# EAGLE design Comunicação RS232 (EAGLE 6.6.0)
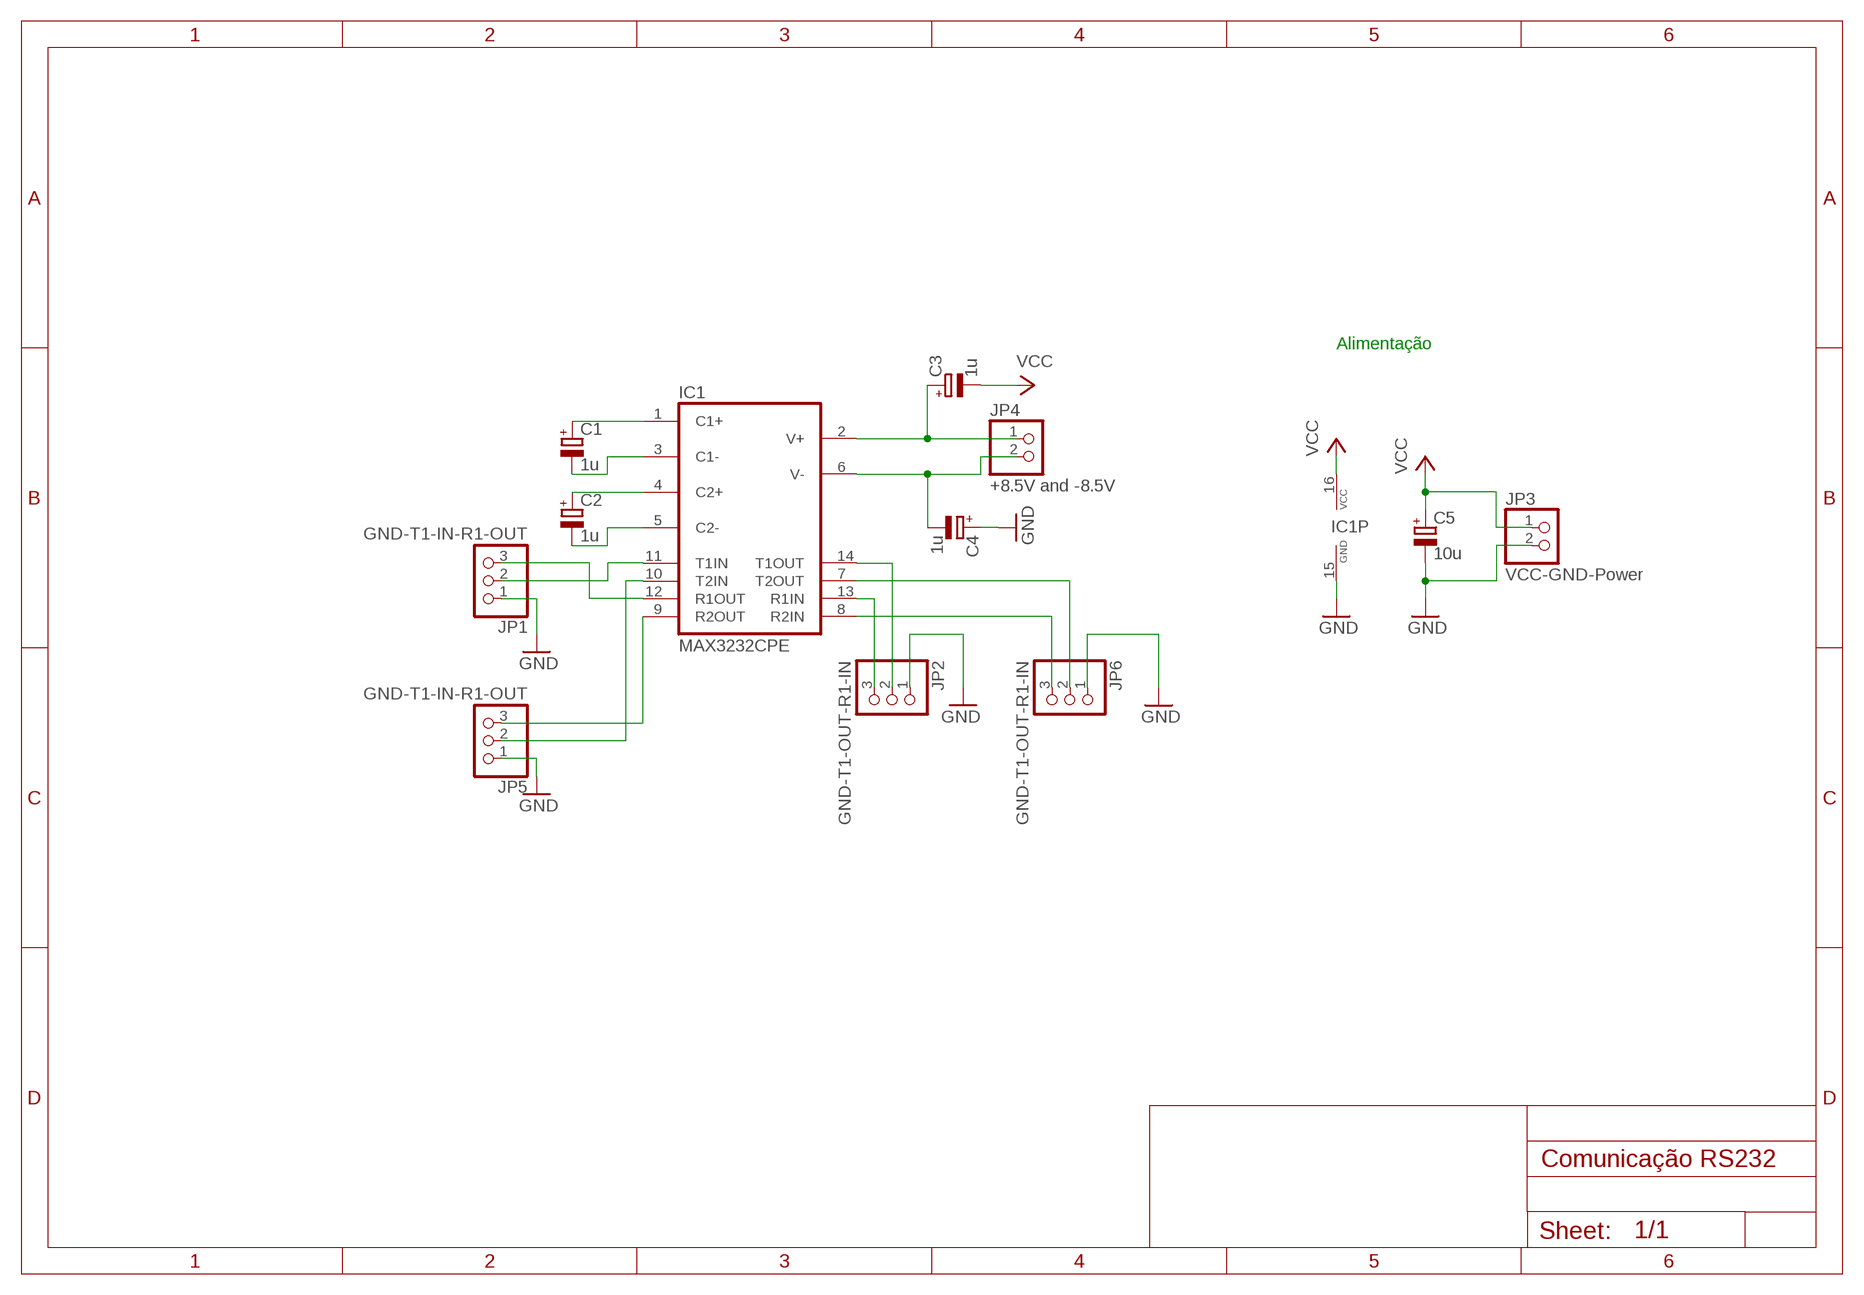
[diagram p0: schematic, sheet 1]

## Parts
C1  1u  CPOL-EUE2.5-5  [E2,5-5]
C2  1u  CPOL-EUE2.5-5  [E2,5-5]
C3  1u  CPOL-EUE2.5-5  [E2,5-5]
C4  1u  CPOL-EUE2.5-5  [E2,5-5]
C5  10u  CPOL-EUE2.5-5  [E2,5-5]
IC1  MAX3232CPE  [DIL16]
JP1  GND-T1-IN-R1-OUT  PINHD-1X3  [1X03]
JP2  GND-T1-OUT-R1-IN  PINHD-1X3  [1X03]
JP3  VCC-GND-Power  PINHD-1X2  [1X02]
JP4  +8.5V and -8.5V  PINHD-1X2  [1X02]
JP5  GND-T1-IN-R1-OUT  PINHD-1X3  [1X03]
JP6  GND-T1-OUT-R1-IN  PINHD-1X3  [1X03]

## Nets
GND: C4.+ C5.- IC1.15(GND) JP1.1 JP2.1 JP3.2 JP5.1 JP6.1
N$1: IC1.11(T1IN) JP1.2
N$2: IC1.12(R1OUT) JP1.3
N$3: C1.+ IC1.1(C1+)
N$4: C1.- IC1.3(C1-)
N$5: C2.+ IC1.4(C2+)
N$6: C2.- IC1.5(C2-)
N$7: C4.- IC1.6(V-) JP4.2
N$8: C3.+ IC1.2(V+) JP4.1
N$9: IC1.14(T1OUT) JP2.2
N$10: IC1.13(R1IN) JP2.3
N$11: IC1.9(R2OUT) JP5.3
N$12: IC1.10(T2IN) JP5.2
N$14: IC1.8(R2IN) JP6.3
N$15: IC1.7(T2OUT) JP6.2
VCC: C3.- C5.+ IC1.16(VCC) JP3.1

## Notes on the sheet
- Alimentação

## Library data of the parts
C1-C5 = rcl:CPOL-EU: POLARIZED CAPACITOR, European symbol
IC1 = maxim:MAX3232*: True RS-232 Transceivers 3.0V to 5.5V, Low-Power up to 1Mbps, Using Four 0.1µF External Capacitors Source: http://pdfserv.maxim-ic.com/en/ds/MAX3222-MAX3241.pdf; MF: MAXIM; MPN: MAX3232CPE+; OC_FARNELL: 9724494; OC_NEWARK: 68K4626
JP1 JP2 JP5 JP6 = pinhead:PINHD-1X3: PIN HEADER
JP3 JP4 = pinhead:PINHD-1X2: PIN HEADER

## Board
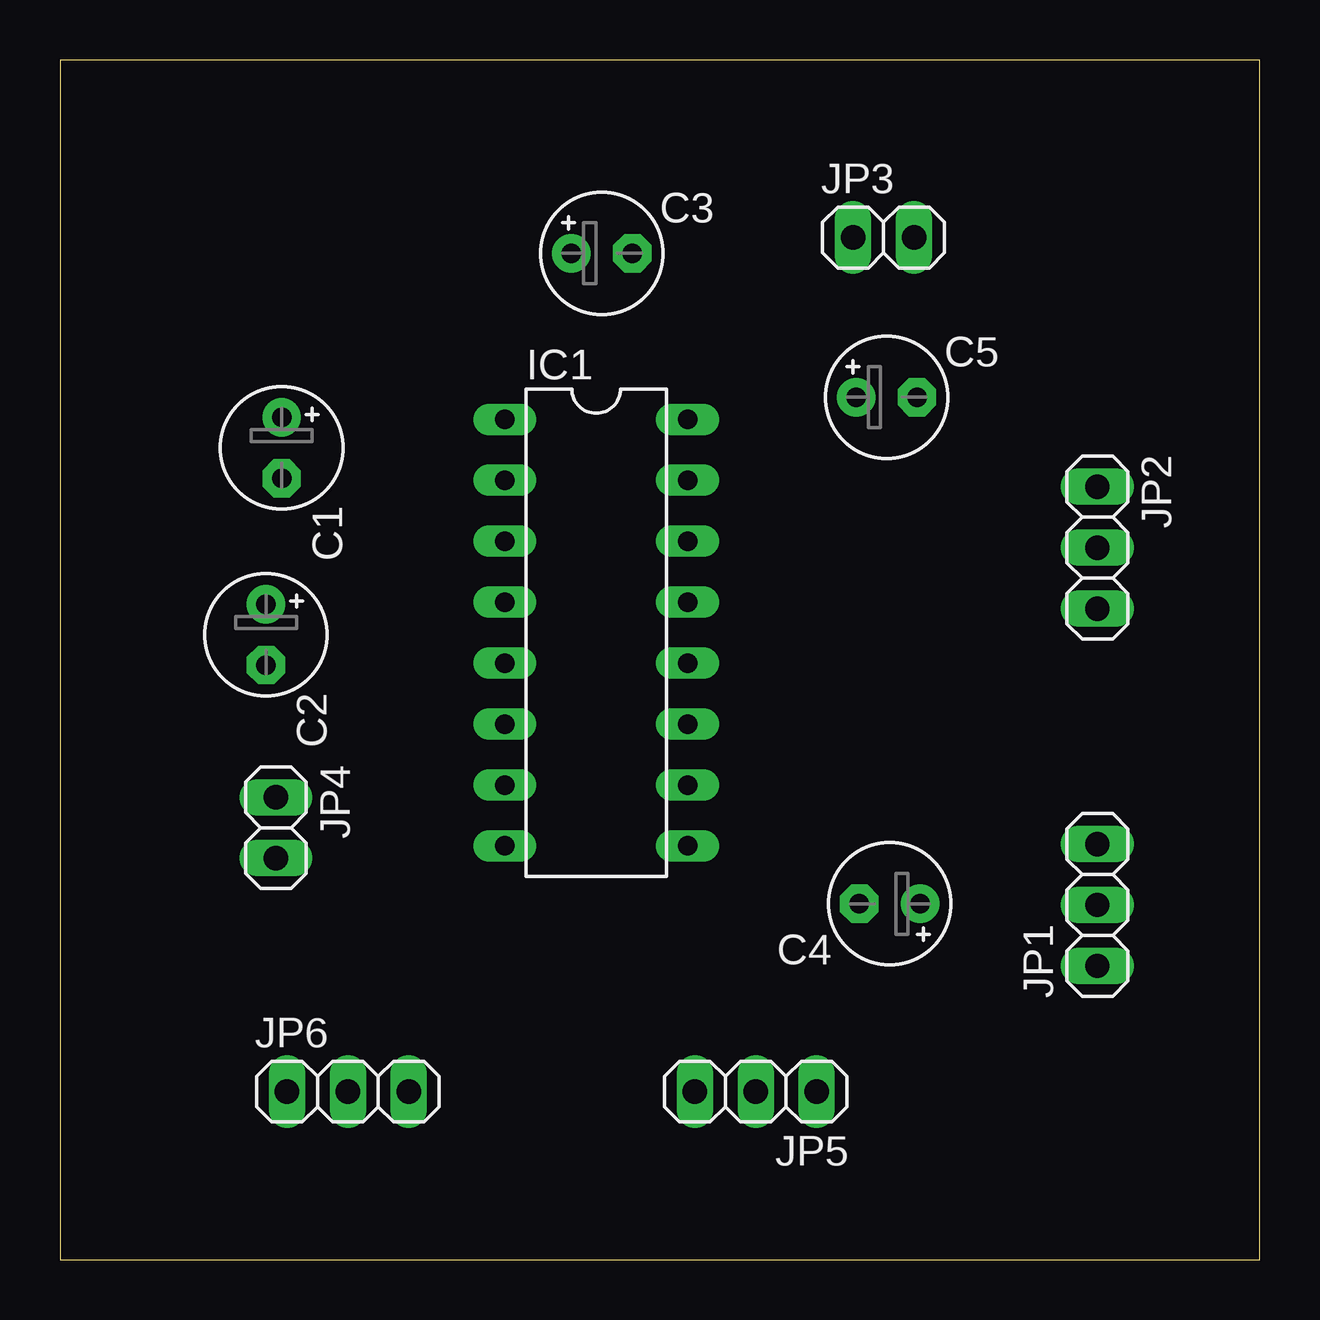
[diagram p1: board, top side]
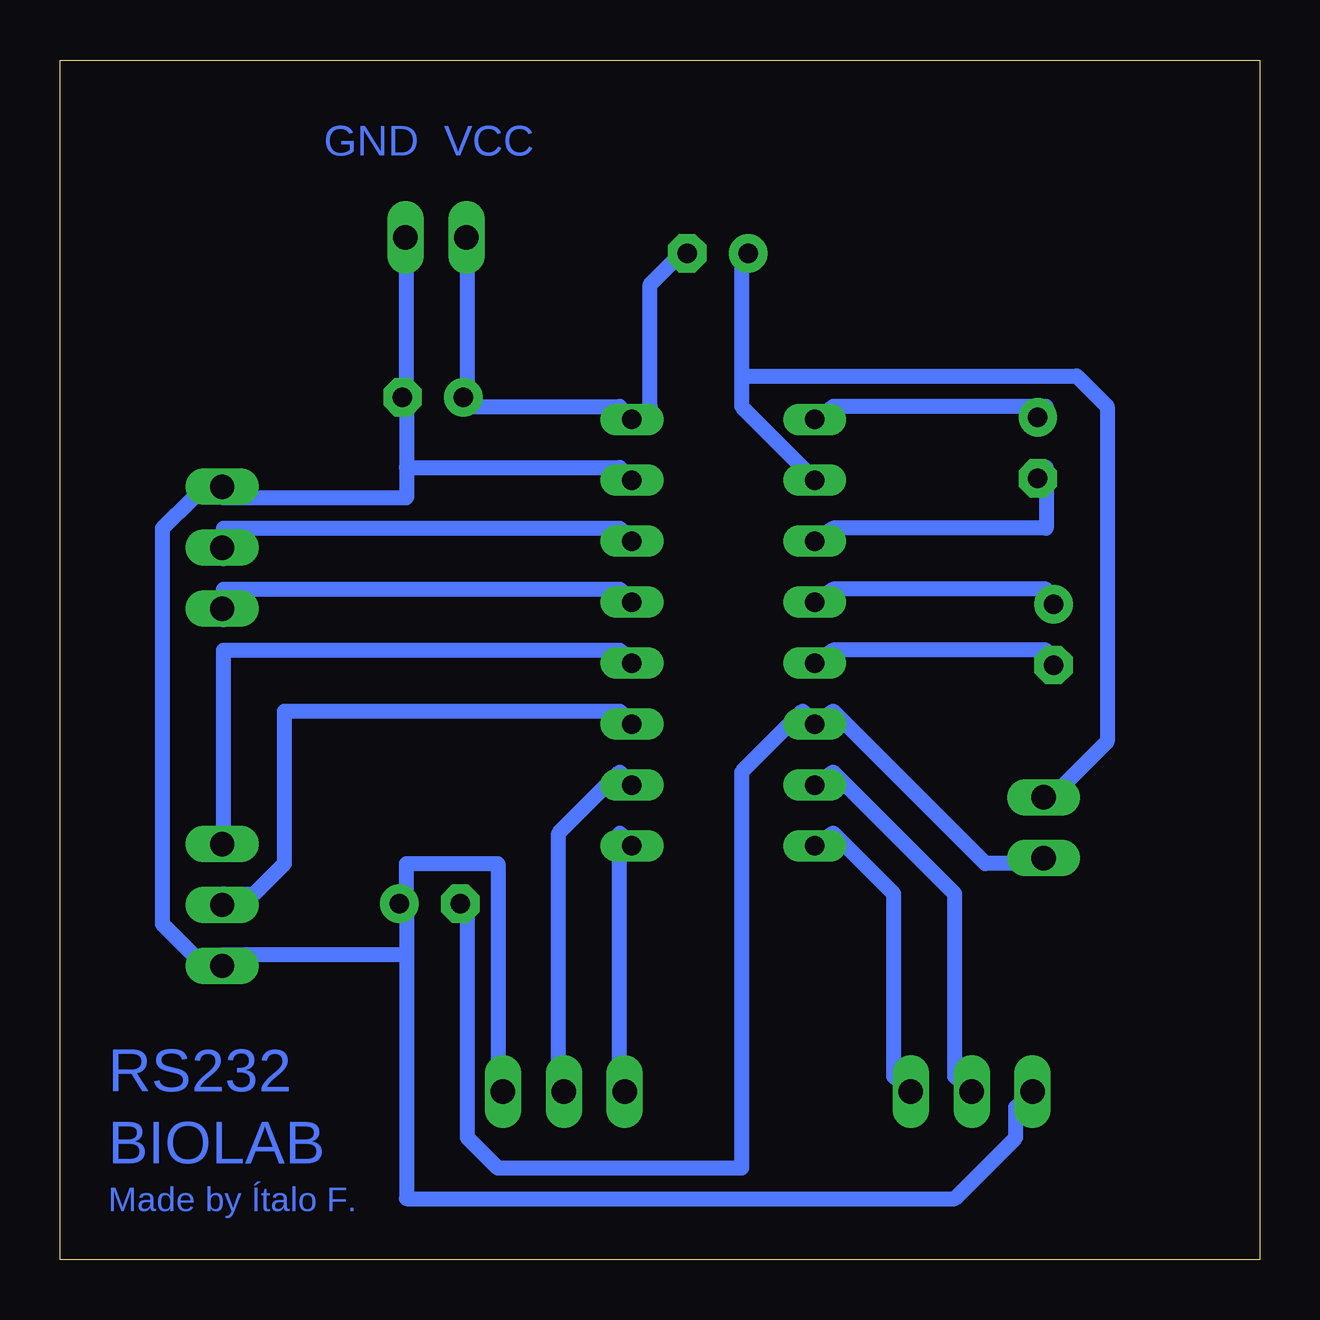
[diagram p2: board, bottom side, seen from below]

Size 50 x 50 mm. Coordinates in mm from the lower left corner, seen from the top.
Outline: 0,0 50,0 50,50 0,50 0,0
Copper layers (1*16): Top 0.035mm / dielectric 1.5mm / Bottom 0.035mm
Design rules "default *": minimum track width 25mil, minimum drill 24mil, track to track 20mil, track to pad 10mil, pad to pad 10mil, via to via 10mil, smd to smd 10mil, copper to edge 80mil, drill to drill 8mil, minimum pad ring 10mil, minimum via ring 8mil, stop-mask expansion 4mil, vias tented up to drill 0mil, thermal gap 10mil

### Footprints (pad centres in the part's own frame; a part is rotated, then mirrored left to right if it is on the bottom)
E2,5-5 = drill 0.813 pad 1.6: + -1.27,0 | drill 0.813 pad 1.6 octagon: - 1.27,0
DIL16 = drill 0.813 long: 1 -8.89,-3.81; 2 -6.35,-3.81; 3 -3.81,-3.81; 4 -1.27,-3.81; 5 1.27,-3.81; 6 3.81,-3.81; 7 6.35,-3.81; 8 8.89,-3.81; 9 8.89,3.81; 10 6.35,3.81; 11 3.81,3.81; 12 1.27,3.81; 13 -1.27,3.81; 14 -3.81,3.81; 15 -6.35,3.81; 16 -8.89,3.81
1X03 = drill 1.016 long: 1 -2.54,0; 2 0,0; 3 2.54,0
1X02 = drill 1.016 long: 1 -1.27,0; 2 1.27,0

### Placement (x,y rotation side)
C1  9.24,33.83 270 top
C2  8.59,26.05 270 top
C3  22.59,41.94 0 top
C4  34.59,14.83 180 top
C5  34.45,35.94 0 top
IC1  22.35,26.13 270 top
JP1  43.24,14.78 90 top
JP2  43.24,29.67 270 top
JP3  34.33,42.6 0 top
JP4  9,18 270 top
JP5  29,7 180 top
JP6  12,7 0 top

### Tracks (layer width: path | path; a pad name or v marks a point on that pad's centre or on a via)
GND
  Bottom 0.635: 35.56,33.02 26.67,33.02 IC1.15 | 35.56,35.56 35.56,33.02 | 35.56,35.56 35.56,41.91 JP3.2 | 35.56,35.56 C5.- | 35.56,33.02 35.56,31.75 43.18,31.75 JP2.1 44.45,31.75 45.72,30.48 45.72,13.97 44.45,12.7 JP1.1 43.18,12.7 35.56,12.7 | 35.56,15.24 35.56,12.7 | 35.56,12.7 35.56,2.54 12.7,2.54 10.16,5.08 10.16,6.35 JP6.1 | 35.56,15.24 35.56,16.51 31.75,16.51 31.75,7.62 JP5.1 | 35.56,15.24 C4.+
N$1
  Bottom 0.635: IC1.11 26.67,22.86 40.64,22.86 40.64,16.51 41.91,15.24 43.18,15.24 JP1.2
N$2
  Bottom 0.635: IC1.12 26.67,25.4 43.18,25.4 43.18,17.78 JP1.3
N$3
  Bottom 0.635: IC1.1 17.78,35.56 8.89,35.56 C1.+
N$4
  Bottom 0.635: IC1.3 17.78,30.48 8.89,30.48 8.89,33.02 C1.-
N$5
  Bottom 0.635: IC1.4 17.78,27.94 8.89,27.94 C2.+
N$6
  Bottom 0.635: IC1.5 17.78,25.4 8.89,25.4 C2.-
N$7
  Bottom 0.635: JP4.2 10.16,16.51 11.43,16.51 17.78,22.86 IC1.6 19.05,22.86 21.59,20.32 21.59,3.81 31.75,3.81 33.02,5.08 33.02,15.24 C4.-
N$8
  Bottom 0.635: 21.59,36.83 21.59,41.91 C3.+ | 21.59,36.83 21.59,35.56 19.05,33.02 IC1.2 | 21.59,36.83 7.62,36.83 6.35,35.56 6.35,21.59 8.89,19.05 JP4.1
N$9
  Bottom 0.635: IC1.14 26.67,30.48 43.18,30.48 43.18,29.21 JP2.2
N$10
  Bottom 0.635: IC1.13 26.67,27.94 43.18,27.94 43.18,26.67 JP2.3
N$11
  Bottom 0.635: IC1.9 26.67,17.78 26.67,7.62 JP5.3
N$12
  Bottom 0.635: IC1.10 26.67,20.32 29.21,17.78 29.21,7.62 JP5.2
N$14
  Bottom 0.635: IC1.8 17.78,17.78 15.24,15.24 15.24,7.62 JP6.3
N$15
  Bottom 0.635: IC1.7 17.78,20.32 12.7,15.24 12.7,7.62 JP6.2
VCC
  Bottom 0.635: 33.02,35.56 26.67,35.56 IC1.16 25.4,35.56 25.4,40.64 24.13,41.91 C3.- | 33.02,35.56 33.02,41.91 JP3.1 | 33.02,35.56 C5.+

### Text on the board
Bottom: VCC | GND | RS232 | BIOLAB | Made by Ítalo F.